# Altium schematic sheet Parallel Interfaces.SchDoc: Cypress Molson - Parallel Interfaces
size B; CompanyName: Linear Systems Ltd.; DrawnBy: G. Cosens; Engineer: G. Cosens; Organization: Linear Systems Ltd.; Address1: 1717 Dublin Avenue, Unit 1; Address2: Winnipeg, MB, Canada; Address3: R3H 0H2; DocumentNumber: LS7652; Revision: 1; SheetNumber: 06; SheetTotal: 12
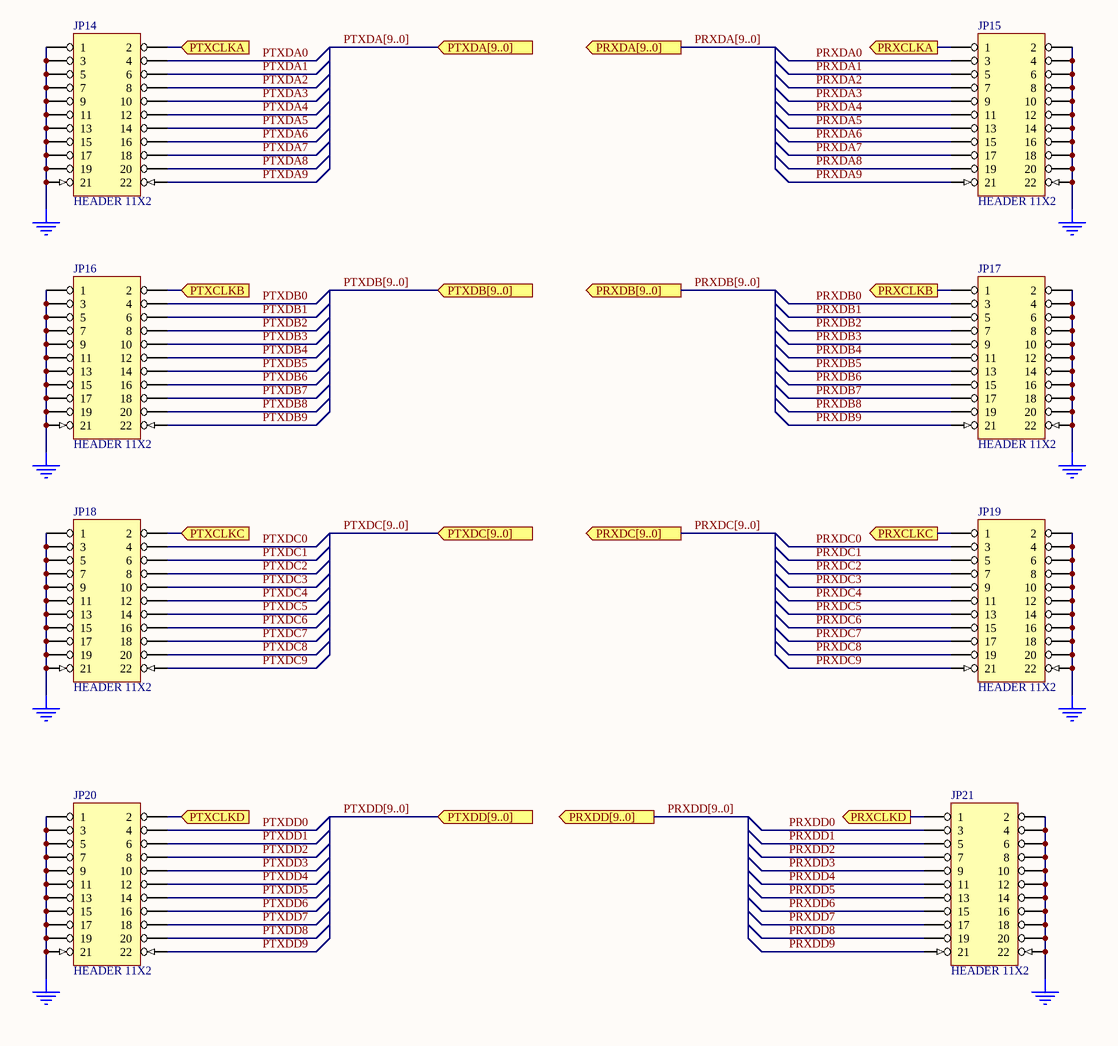
[diagram p0: Parallel Interfaces.SchDoc]

## Parts
JP14  (no value)  [2X11PIN]
JP15  (no value)  [2X11PIN]
JP16  (no value)  [2X11PIN]
JP17  (no value)  [2X11PIN]
JP18  (no value)  [2X11PIN]
JP19  (no value)  [2X11PIN]
JP20  (no value)  [2X11PIN]
JP21  (no value)  [2X11PIN]

## Ports
PRXCLKA (out), PRXCLKB (out), PRXCLKC (out), PRXCLKD (out), PRXDA[9..0] (out), PRXDB[9..0] (out), PRXDC[9..0] (out), PRXDD[9..0] (out), PTXCLKA (in), PTXCLKB (in), PTXCLKC (in), PTXCLKD (in), PTXDA[9..0] (in), PTXDB[9..0] (in), PTXDC[9..0] (in), PTXDD[9..0] (in)

## Nets
GND: JP14.1 JP14.3 JP14.5 JP14.7 JP14.9 JP14.11 JP14.13 JP14.15 JP14.17 JP14.19 JP14.21 JP15.2 JP15.4 JP15.6 JP15.8 JP15.10 JP15.12 JP15.14 JP15.16 JP15.18 JP15.20 JP15.22 JP16.1 JP16.3 JP16.5 JP16.7 JP16.9 JP16.11 JP16.13 JP16.15 JP16.17 JP16.19 JP16.21 JP17.2 JP17.4 JP17.6 JP17.8 JP17.10 JP17.12 JP17.14 JP17.16 JP17.18 JP17.20 JP17.22 JP18.1 JP18.3 JP18.5 JP18.7 JP18.9 JP18.11 JP18.13 JP18.15 JP18.17 JP18.19 JP18.21 JP19.2 JP19.4 JP19.6 JP19.8 JP19.10 JP19.12 JP19.14 JP19.16 JP19.18 JP19.20 JP19.22 JP20.1 JP20.3 JP20.5 JP20.7 JP20.9 JP20.11 JP20.13 JP20.15 JP20.17 JP20.19 JP20.21 JP21.2 JP21.4 JP21.6 JP21.8 JP21.10 JP21.12 JP21.14 JP21.16 JP21.18 JP21.20 JP21.22
PRXCLKA: JP15.1 ; port PRXCLKA
PRXCLKB: JP17.1 ; port PRXCLKB
PRXCLKC: JP19.1 ; port PRXCLKC
PRXCLKD: JP21.1 ; port PRXCLKD
PRXDA0: JP15.3
PRXDA1: JP15.5
PRXDA2: JP15.7
PRXDA3: JP15.9
PRXDA4: JP15.11
PRXDA5: JP15.13
PRXDA6: JP15.15
PRXDA7: JP15.17
PRXDA8: JP15.19
PRXDA9: JP15.21
PRXDB0: JP17.3
PRXDB1: JP17.5
PRXDB2: JP17.7
PRXDB3: JP17.9
PRXDB4: JP17.11
PRXDB5: JP17.13
PRXDB6: JP17.15
PRXDB7: JP17.17
PRXDB8: JP17.19
PRXDB9: JP17.21
PRXDC0: JP19.3
PRXDC1: JP19.5
PRXDC2: JP19.7
PRXDC3: JP19.9
PRXDC4: JP19.11
PRXDC5: JP19.13
PRXDC6: JP19.15
PRXDC7: JP19.17
PRXDC8: JP19.19
PRXDC9: JP19.21
PRXDD0: JP21.3
PRXDD1: JP21.5
PRXDD2: JP21.7
PRXDD3: JP21.9
PRXDD4: JP21.11
PRXDD5: JP21.13
PRXDD6: JP21.15
PRXDD7: JP21.17
PRXDD8: JP21.19
PRXDD9: JP21.21
PTXCLKA: JP14.2 ; port PTXCLKA
PTXCLKB: JP16.2 ; port PTXCLKB
PTXCLKC: JP18.2 ; port PTXCLKC
PTXCLKD: JP20.2 ; port PTXCLKD
PTXDA0: JP14.4
PTXDA1: JP14.6
PTXDA2: JP14.8
PTXDA3: JP14.10
PTXDA4: JP14.12
PTXDA5: JP14.14
PTXDA6: JP14.16
PTXDA7: JP14.18
PTXDA8: JP14.20
PTXDA9: JP14.22
PTXDB0: JP16.4
PTXDB1: JP16.6
PTXDB2: JP16.8
PTXDB3: JP16.10
PTXDB4: JP16.12
PTXDB5: JP16.14
PTXDB6: JP16.16
PTXDB7: JP16.18
PTXDB8: JP16.20
PTXDB9: JP16.22
PTXDC0: JP18.4
PTXDC1: JP18.6
PTXDC2: JP18.8
PTXDC3: JP18.10
PTXDC4: JP18.12
PTXDC5: JP18.14
PTXDC6: JP18.16
PTXDC7: JP18.18
PTXDC8: JP18.20
PTXDC9: JP18.22
PTXDD0: JP20.4
PTXDD1: JP20.6
PTXDD2: JP20.8
PTXDD3: JP20.10
PTXDD4: JP20.12
PTXDD5: JP20.14
PTXDD6: JP20.16
PTXDD7: JP20.18
PTXDD8: JP20.20
PTXDD9: JP20.22

## Buses and harness runs
bus PRXDA[9..0] = port PRXDA[9..0]
bus PRXDB[9..0] = port PRXDB[9..0]
bus PRXDC[9..0] = port PRXDC[9..0]
bus PRXDD[9..0] = port PRXDD[9..0]
bus PTXDA[9..0] = port PTXDA[9..0]
bus PTXDB[9..0] = port PTXDB[9..0]
bus PTXDC[9..0] = port PTXDC[9..0]
bus PTXDD[9..0] = port PTXDD[9..0]

## Notes on the sheet
- Size
- Date:
- B
- Drawing Number
- Sheet
- Revision
- of
- File:
- Drawn By:
- G. Cosens

## Library data of the parts
JP14-JP21 = HEADER 11X2